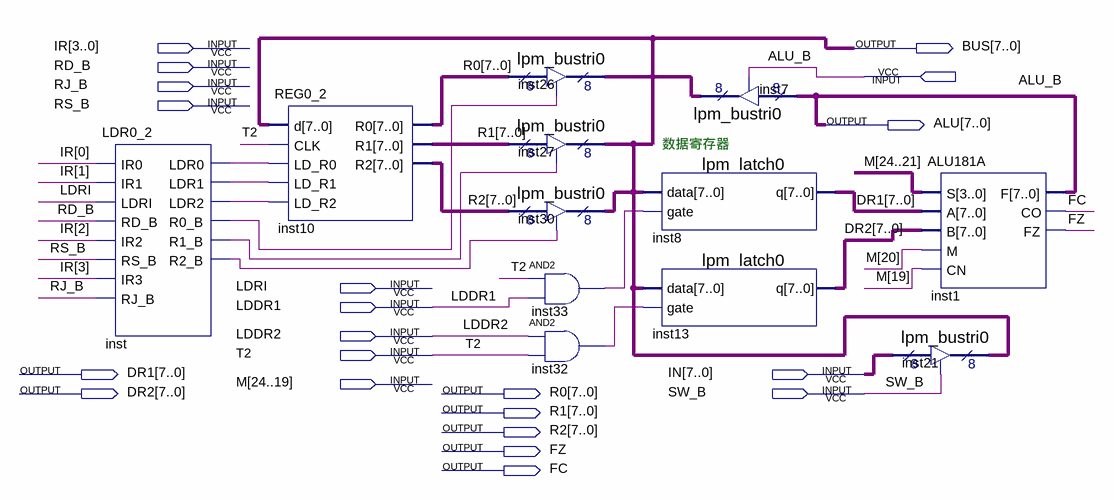
[diagram p0: schematic sheet]
// Quartus schematic ALU_MD.bdf as structural Verilog: 12 symbols, 21 pins
module ALU_MD (
  input  [3:0] IR,
  input  RD_B,
  input  ALU_B,
  input  RJ_B,
  input  RS_B,
  input  LDRI,
  input  LDDR1,
  input  LDDR2,
  input  T2,
  input  [7:0] IN,
  input  [24:19] M,
  input  SW_B,
  output [7:0] BUS,
  output [7:0] ALU,
  output [7:0] DR1,
  output [7:0] DR2,
  output [7:0] R0,
  output [7:0] R1,
  output [7:0] R2,
  output FZ,
  output FC
);

  wire inst32_out, inst33_out, inst_ldr0, inst_ldr1, inst_ldr2, inst_r0_b, inst_r1_b, inst_r2_b;

  LDR0_2 inst (
    .IR0(IR[0]), .IR1(IR[1]), .LDRI(LDRI), .RD_B(RD_B), .IR2(IR[2]), .RS_B(RS_B), .IR3(IR[3]), .RJ_B(RJ_B),
    .LDR0(inst_ldr0), .LDR1(inst_ldr1), .LDR2(inst_ldr2), .R0_B(inst_r0_b), .R1_B(inst_r1_b), .R2_B(inst_r2_b));
  REG0_2 inst10 (.d(BUS), .CLK(T2), .LD_R0(inst_ldr0), .LD_R1(inst_ldr1), .LD_R2(inst_ldr2), .R0(R0), .R1(R1), .R2(R2));
  lpm_bustri0 inst26 (.enabledt(inst_r0_b), .data(R0), .tridata(BUS));
  lpm_bustri0 inst27 (.enabledt(inst_r1_b), .data(R1), .tridata(BUS));
  lpm_bustri0 inst30 (.enabledt(inst_r2_b), .data(R2), .tridata(BUS));
  and inst33 (inst33_out, T2, LDDR1);
  and inst32 (inst32_out, LDDR2, T2);
  lpm_latch0 inst8 (.data(BUS), .gate(inst33_out), .q(DR1));
  lpm_latch0 inst13 (.data(BUS), .gate(inst32_out), .q(DR2));
  lpm_bustri0 inst7 (.enabledt(ALU_B), .data(ALU), .tridata(BUS));
  lpm_bustri0 inst21 (.enabledt(SW_B), .data(IN), .tridata(BUS));
  ALU181A inst1 (.S(M[24:21]), .A(DR1), .B(DR2), .M(M[20]), .CN(M[19]), .F(ALU), .CO(FC), .FZ(FZ));

  // Notes on the sheet:
  //   数据寄存器
endmodule
